# Altium schematic sheet 智能灯控制器.SchDoc
size 292 x 218 mm
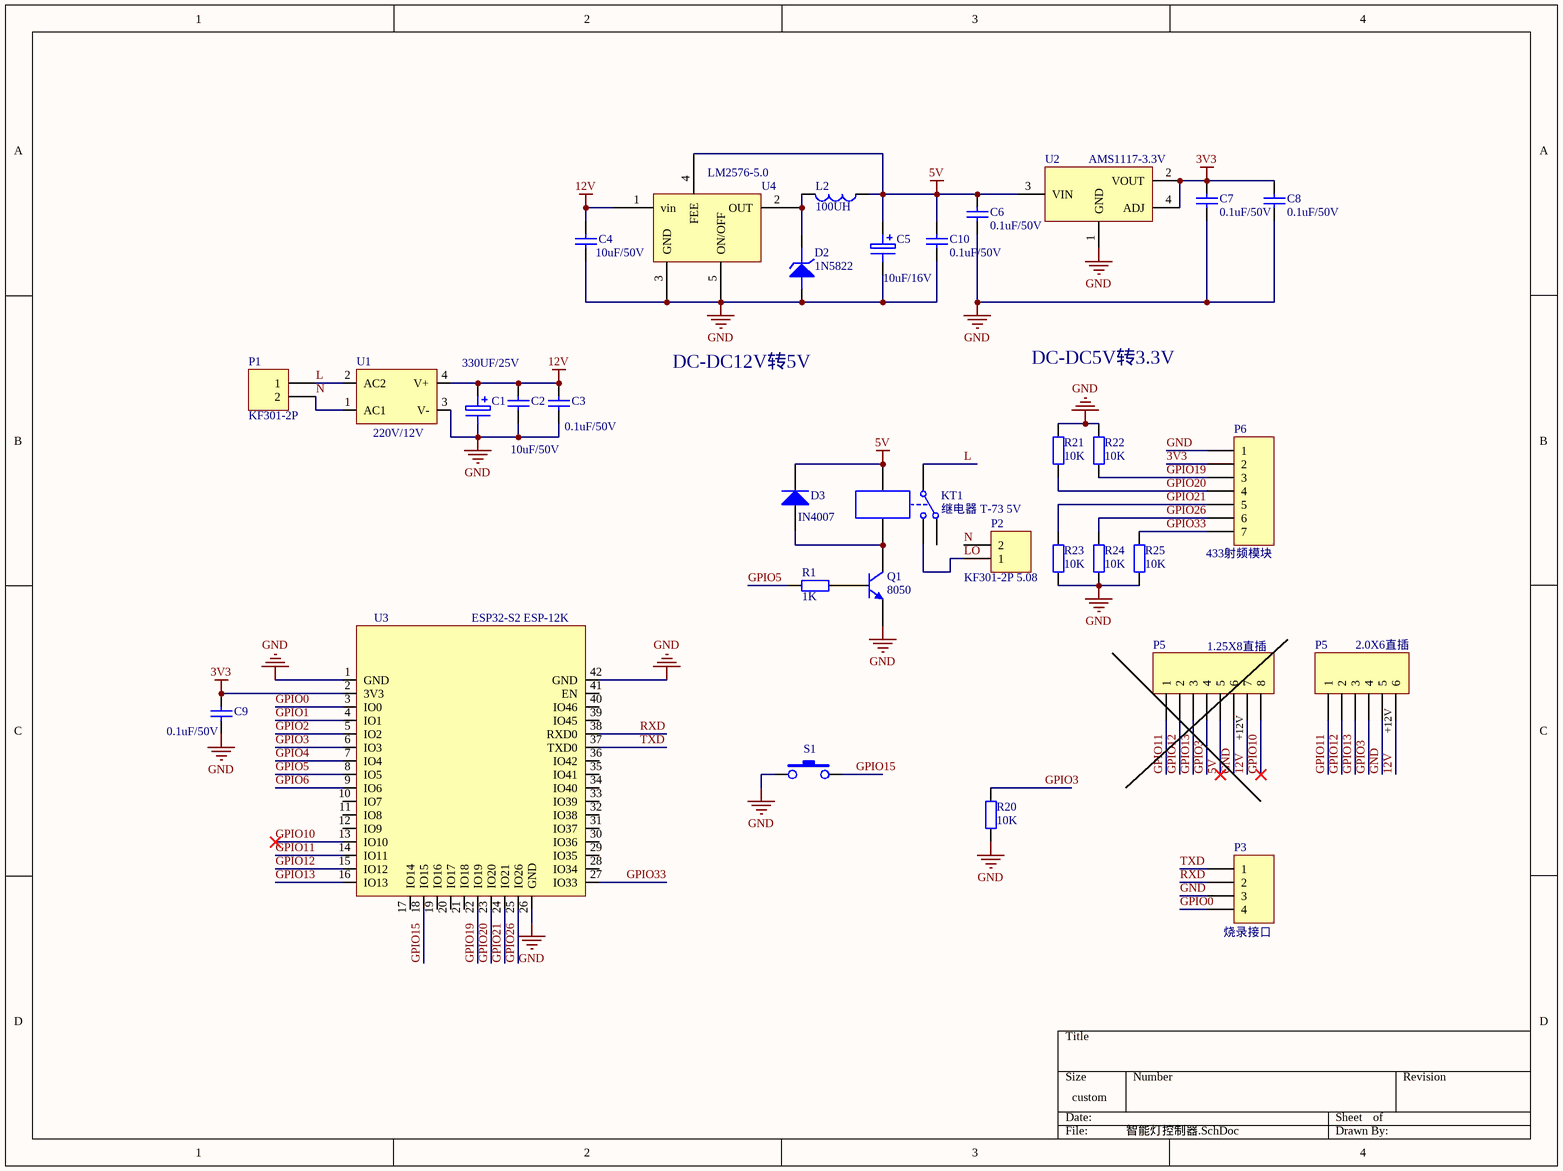
[diagram p0: 智能灯控制器.SchDoc]

## Parts
(Parts that share a designator on the sheet are numbered #1, #2 ... from top to bottom, then left to right.)
C1  330UF/25V  [C6X8]
C2  10uF/50V  [1206C]
C3  0.1uF/50V  [0805]
C4  10uF/50V  [1206C]
C5  10uF/16V  [3216]
C6  0.1uF/50V  [0805]
C7  0.1uF/50V  [0805]
C8  0.1uF/50V  [0805]
C9  0.1uF/50V  [0805]
C10  0.1uF/50V  [0805]
D2  1N5822  [DO-214AC]
D3  IN4007  [SMA]
KT1  继电器 T-73 5V  [继电器 T-73直流SONGLE松乐小微型电磁继电器 SRD-24VDC-SL-C 5脚24Vdc]
L2  100UH  [SMD7*7]
P1  KF301-2P  [Z座KF301-2P 5.08]
P2  KF301-2P 5.08  [Z座KF301-2P 5.08]
P3  烧录接口  [HDR1X4]
P5#1  1.25X8直插  [HDR3X8 1.25]
P5#2  2.0X6直插  [HDR1X6]
P6  433射频模块  [HDR1X7]
Q1  8050  [SOT23_N BEC 123]
R1  1K  [0805]
R20  10K  [0805]
R21  10K  [0805]
R22  10K  [0805]
R23  10K  [0805]
R24  10K  [0805]
R25  10K  [0805]
S1  KEY  [key - 1]  (value not drawn)
U1  220V/12V  [模块电源12V10W 认证款 - 贴2]
U2  AMS1117-3.3V  [SOT223]
U3  ESP32-S2 ESP-12K
U4  LM2576-5.0  [TO-263-5]

## Nets
3V3: C7.2 C8.2 C9.2 P6.2 U2.2(VOUT) U2.4(ADJ) U3.2(3V3)
5V: C5.1 C6.2 C10.2 D3.2(K) KT1.2 L2.1 P5#1.5 U2.3(VIN) U4.4(FEE)
12V: C1.1 C2.2 C3.2 C4.2 P5#1.7 P5#2.6 U1.4(V+) U4.1(vin)
GND: C1.2 C2.1 C3.1 C4.1 C5.2 C6.1 C7.1 C8.1 C9.1 C10.1 D2.1(A) P3.3 P5#1.6 P5#2.5 P6.1 Q1.2 R20.2 R21.1 R22.1 R23.2 R24.2 R25.2 S1.1 U1.3(V-) U2.1(GND) U3.1(GND) U3.26(GND) U3.42(GND) U4.3(GND) U4.5(ON/OFF)
GPIO0: P3.4 U3.3(IO0)
GPIO1: U3.4(IO1)
GPIO2: U3.5(IO2)
GPIO3: P5#1.4 P5#2.4 R20.1 U3.6(IO3)
GPIO4: U3.7(IO4)
GPIO5: R1.2 U3.8(IO5)
GPIO6: U3.9(IO6)
GPIO10: P5#1.8 U3.13(IO10)
GPIO11: P5#1.1 P5#2.1 U3.14(IO11)
GPIO12: P5#1.2 P5#2.2 U3.15(IO12)
GPIO13: P5#1.3 P5#2.3 U3.16(IO13)
GPIO15: S1.2 U3.18(IO15)
GPIO19: P6.3 R22.2 U3.22(IO19)
GPIO20: P6.4 R21.2 U3.23(IO20)
GPIO21: P6.5 R23.1 U3.24(IO21)
GPIO26: P6.6 R24.1 U3.25(IO26)
GPIO33: P6.7 R25.1 U3.27(IO33)
L: KT1.3 P1.1 U1.2(AC2)
LO: KT1.5 P2.1
N: P1.2 P2.2 U1.1(AC1)
RXD: P3.2 U3.38(RXD0)
TXD: P3.1 U3.37(TXD0)
NetD2_2: D2.2(K) L2.2 U4.2(OUT)
NetD3_1: D3.1(A) KT1.1 Q1.3
NetQ1_1: Q1.1 R1.1

Not connected (* = marked no-connect by the designer): KT1 4; U3 10(IO7) 11(IO8) 12(IO9) 17(IO14) 19(IO16) 20(IO17) 21(IO18) 28(IO34) 29(IO35) 30(IO36) 31(IO37) 32(IO38) 33(IO39) 34(IO40) 35(IO41) 36(IO42) 39(IO45) 40(IO46) 41(EN)

## Notes on the sheet
- DC-DC12V转5V
- DC-DC5V转3.3V
- (near P5#1) +12V
- (near P5#2) +12V

## Library data of the parts
C1 C5 = ELECTRO1: Electrolytic Capacitor
C2-C4 C6-C10 = C: Published: 8-Jun-2000; LatestRevisionDate: 17-Jul-2002; LatestRevisionNote: Re-released for DXP Platform.; PackageReference: RAD-0.3; Publisher: Altium Limited; PackageDescription: Radial Cap, Thru-Hole; 2 Leads; 0.3 in Pin Spacing
D2 = ZENER3: Zener Diode
D3 = D二极管: Published: 8-Jun-2000; LatestRevisionDate: 17-Jul-2002; LatestRevisionNote: Re-released for DXP Platform.; DatasheetVersion: 1998; PackageVersion: Aug-1999; PackageReference: DO-41; Publisher: Altium Limited; PackageDescription: Diode, Axial; Body 5.2 x 2.7 mm (LxDia. max), Lead Dia. 0.86 mm (max); Code_JEDEC: DO-204-AL; ComponentLink1Description: Manufacturer Link; ComponentLink1URL: http://www.fairchildsemi.com/; ComponentLink2Description: Datasheet; ComponentLink2URL: http://www.fairchildsemi.com/ds/1N%2F1N4001.pdf
KT1 = 继电器1
L2 = L1
P1 P2 = Header 2: Header, 2-Pin; LatestRevisionDate: 17-Jul-2002; LatestRevisionNote: Re-released for DXP Platform.; Publisher: Altium Limited
P3 = Header 4: Header, 4-Pin; LatestRevisionDate: 17-Jul-2002; LatestRevisionNote: Re-released for DXP Platform.; Publisher: Altium Limited
P5#1 = Header 8: Header, 8-Pin; LatestRevisionDate: 17-Jul-2002; LatestRevisionNote: Re-released for DXP Platform.; Publisher: Altium Limited
P5#2 = Header 6: Header, 6-Pin; LatestRevisionDate: 17-Jul-2002; LatestRevisionNote: Re-released for DXP Platform.; Publisher: Altium Limited
P6 = Header 7: Header, 7-Pin; LatestRevisionDate: 17-Jul-2002; LatestRevisionNote: Re-released for DXP Platform.; Publisher: Altium Limited
Q1 = NPN: Published: 8-Jun-2000; LatestRevisionDate: 15-Jan-2003; LatestRevisionNote: PCB Footprint 'BCY-W3/D4.7' replaced; DatasheetVersion: 1997; PackageVersion: Sep-1998; PackageReference: TO-92A; Publisher: Altium Limited; PackageDescription: TO, Flat Index; 3 In-Line, Axial Leads; Body Dia. 4.5mm; Leads 0.51 x 0.48 mm (max); ComponentLink1Description: Manufacturer Link; ComponentLink1URL: http://www.fairchildsemi.com/; ComponentLink2Description: Datasheet; ComponentLink2URL: http://www.fairchildsemi.com/ds/2N%2F2N3904.pdf
R1 R20-R25 = R电阻1: Published: 8-Jun-2000; LatestRevisionDate: 17-Jul-2002; LatestRevisionNote: Re-released for DXP Platform.; PackageReference: AXIAL-0.4; Publisher: Altium Limited; PackageDescription: Axial Device, Thru-Hole; 2 Leads; 0.4 in Pin Spacing
U1 = 模块隔离220
U2 = LM1117